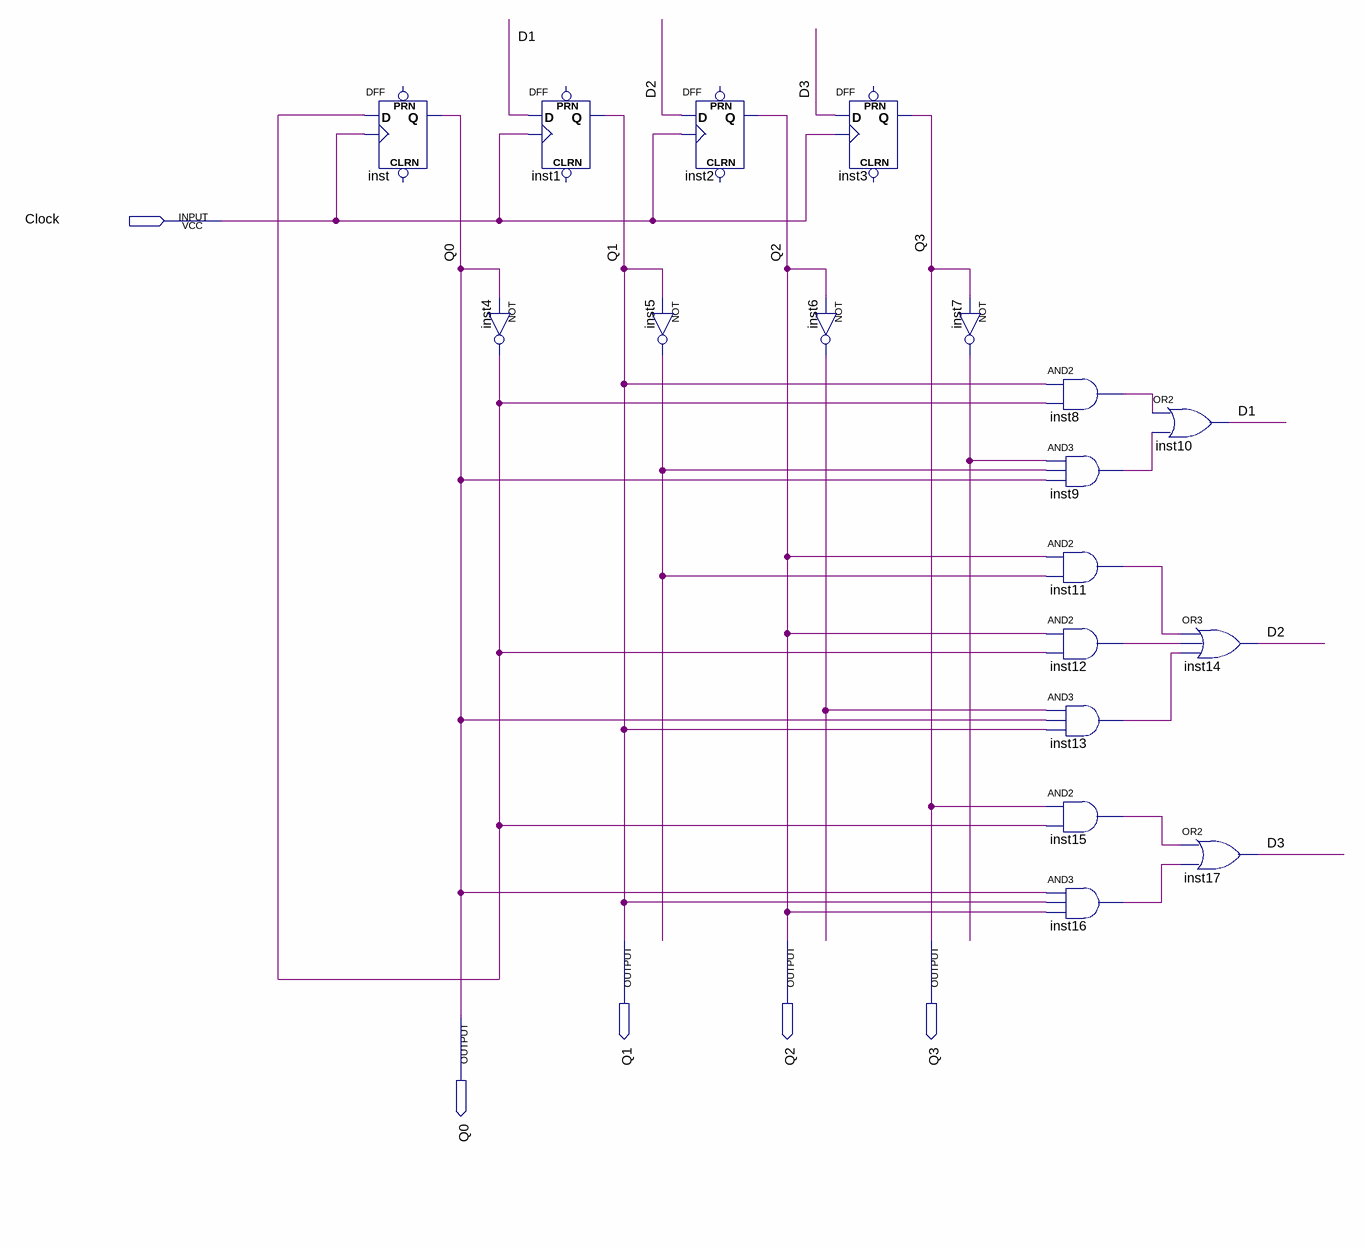
[diagram p0: schematic sheet]
// Quartus schematic BCDcounterDff.bdf as structural Verilog: 18 symbols, 5 pins
module BCDcounterDff (
  input  Clock,
  output Q1,
  output Q2,
  output Q3,
  output Q0
);

  wire D1, D2, D3, inst4_out, inst5_out, inst6_out, inst7_out, inst8_out, inst9_out, inst11_out, inst12_out,
       inst13_out, inst15_out, inst16_out;

  DFF inst (.CLK(Clock), .D(inst4_out), .Q(Q0));  // open: CLRN, PRN
  DFF inst1 (.CLK(Clock), .D(D1), .Q(Q1));  // open: CLRN, PRN
  not inst4 (inst4_out, Q0);
  DFF inst2 (.CLK(Clock), .D(D2), .Q(Q2));  // open: CLRN, PRN
  not inst5 (inst5_out, Q1);
  DFF inst3 (.CLK(Clock), .D(D3), .Q(Q3));  // open: CLRN, PRN
  not inst6 (inst6_out, Q2);
  not inst7 (inst7_out, Q3);
  and inst8 (inst8_out, Q1, inst4_out);
  and inst9 (inst9_out, inst7_out, inst5_out, Q0);
  and inst11 (inst11_out, Q2, inst5_out);
  and inst12 (inst12_out, Q2, inst4_out);
  and inst13 (inst13_out, inst6_out, Q0, Q1);
  and inst15 (inst15_out, Q3, inst4_out);
  and inst16 (inst16_out, Q0, Q1, Q2);
  or inst10 (D1, inst8_out, inst9_out);
  or inst14 (D2, inst11_out, inst12_out, inst13_out);
  or inst17 (D3, inst15_out, inst16_out);
endmodule
